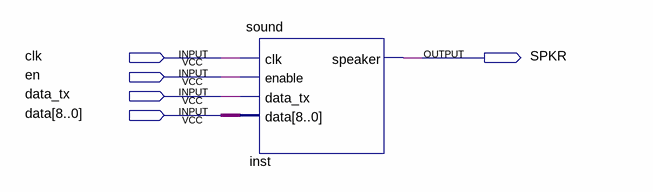
[diagram p0: schematic sheet]
// Quartus schematic sound_test.bdf as structural Verilog: 1 symbols, 5 pins
module sound_test (
  input  clk,
  input  en,
  input  data_tx,
  input  [8:0] data,
  output SPKR
);

  sound inst (.clk(clk), .enable(en), .data_tx(data_tx), .data(data), .speaker(SPKR));
endmodule
